# Altium schematic sheet 06_SENSOR.SchDoc
size A4; PageSetup: Record=PageOptions|CenterHorizontal=True|CenterVertical=True|PrintScale=0.97|XCorrection=1.00|YCorrection=1.00|PrintKind=0|BorderSize=5000000|LeftOffset=0|BottomOffset=0|Orientation=2|PaperLength=1000|PaperWidth=1000|Scale=100|PaperSource=7|PrintQuality=-4|MediaType=1|DitherType=10|PaperKind=A4|PrintScaleMode=1
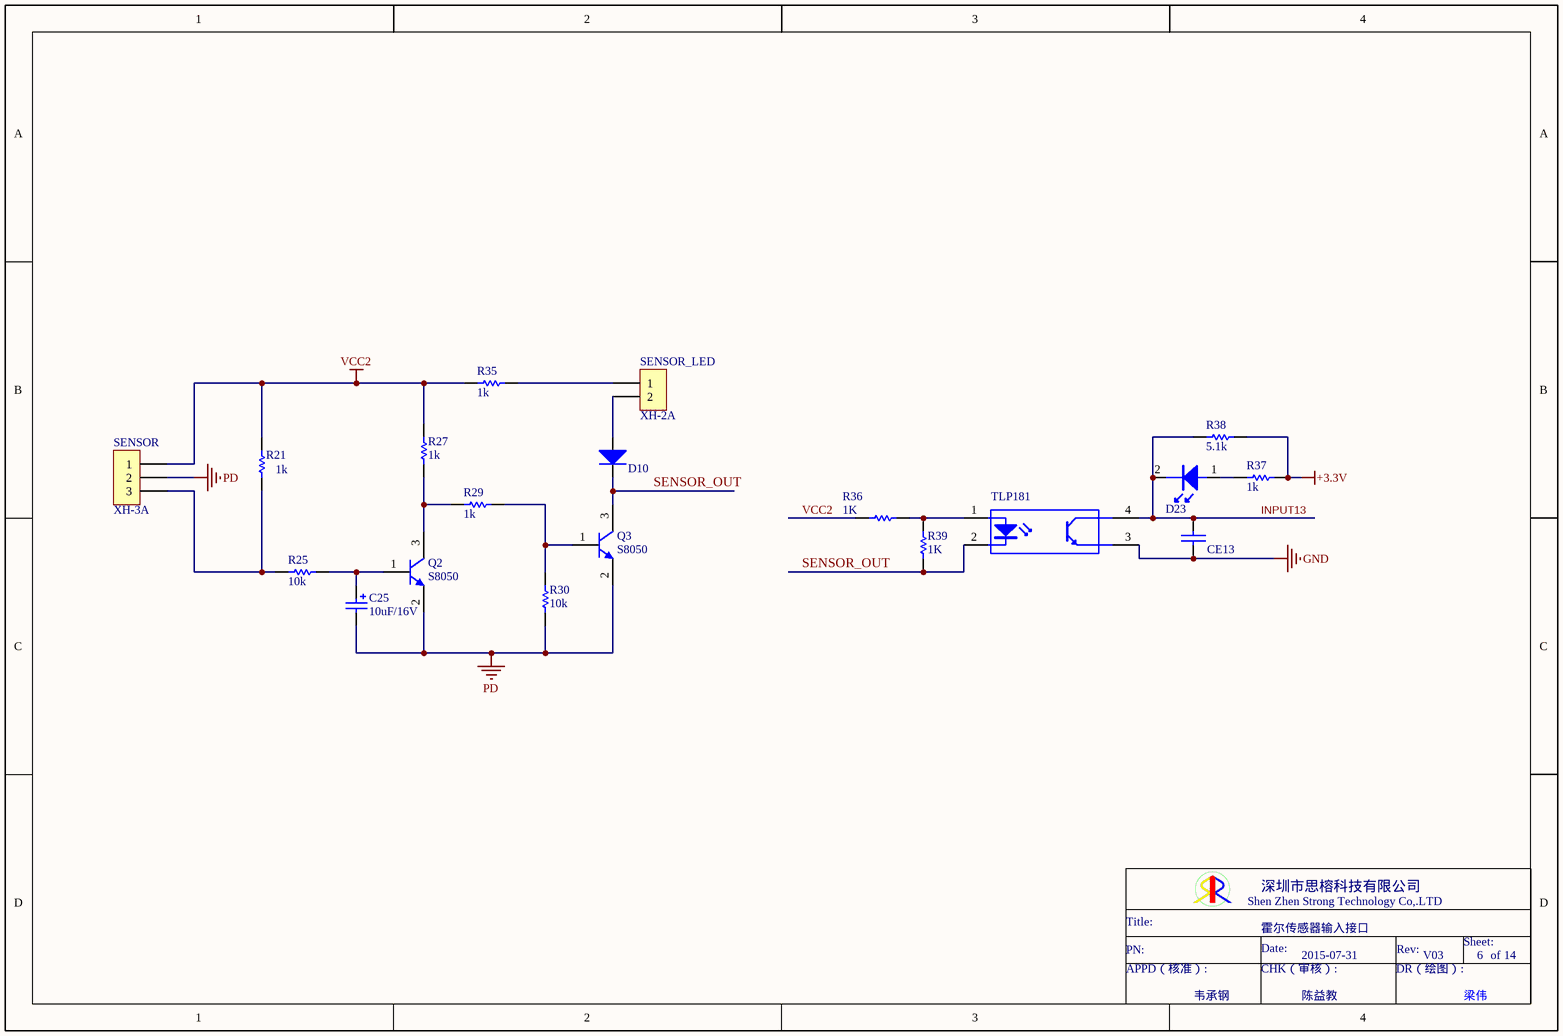
[diagram p0: 06_SENSOR.SchDoc]

## Parts
C25  10uF/16V  [A]
CE13  100pF  [0603C]  (value not drawn)
D10  IN4148W T4  [1206D]  (value not drawn)
D23  LED灯 白发红光  [D0603]  (value not drawn)
Q2  S8050  [SOT23]
Q3  S8050  [SOT23]
R21  1k  [0603R]
R25  10k  [0603R]
R27  1k  [0603R]
R29  1k  [0603R]
R30  10k  [0603R]
R35  1k  [0603R]
R36  1K  [0805R]
R37  1k  [0603R]
R38  5.1k  [0603R]
R39  1K  [0603R]
SENSOR  XH-3A  [CN3-2.54]
SENSOR_LED  XH-2A  [CN2-2.54]
U16  TLP181  [SOP4-2.54]

## Nets
+3.3V: R37.1 R38.1
GND: CE13.2 U16.3(E)
PD: C25.2 Q2.2(E) Q3.2(E) R30.1 SENSOR.2
VCC2: R21.1 R27.2 R35.1 R36.2 SENSOR.1
INPUT13: CE13.1 D23.2 R38.2 U16.4(C)
SENSOR_OUT: D10.2 Q3.3(C) R39.2 U16.2(K)
NetC25_1: C25.1 Q2.1(B) R25.1
NetD10_1: D10.1 SENSOR_LED.2
NetD23_1: D23.1 R37.2
NetQ2_3: Q2.3(C) R27.1 R29.2
NetQ3_1: Q3.1(B) R29.1 R30.2
NetR21_2: R21.2 R25.2 SENSOR.3
NetR35_2: R35.2 SENSOR_LED.1
NetR36_1: R36.1 R39.1 U16.1(A)

## Notes on the sheet
- 霍尔传感器输入接口
- 2015-07-31
- V03
- 6
- 14
- 韦承钢
- 陈益教
- Shen Zhen Strong Technology Co,.LTD
- 深圳市思榕科技有限公司
- Title:
- PN:
- APPD（核准）:
- Date:
- CHK（审核）:
- DR（绘图）:
- Rev:
- Sheet:
- of
- 梁伟

## Library data of the parts
C25 = Cap Pol2: Polarized Capacitor (Axial); Value: 100pF; Published: 8-Jun-2000; LatestRevisionDate: 17-Jul-2002; LatestRevisionNote: Re-released for DXP Platform.; PackageReference: POLAR0.8; Publisher: Altium Limited
CE13 = CAP: Capacitor
D10 = D: 二极管
D23 = LED: LED灯
Q2 Q3 = QNPN: NPN Bipolar Transistor; Published: 8-Jun-2000; LatestRevisionDate: 17-Jul-2002; LatestRevisionNote: Re-released for DXP Platform.; PackageReference: SOT-23B; Publisher: Altium Limited; Code_JEDEC: SOT-23
R21 R25 R27 R29 R30 R35-R39 = RES
SENSOR = CON3
SENSOR_LED = CON2
U16 = TLP521